# EAGLE design PowerRelayBoard (EAGLE 5.11)
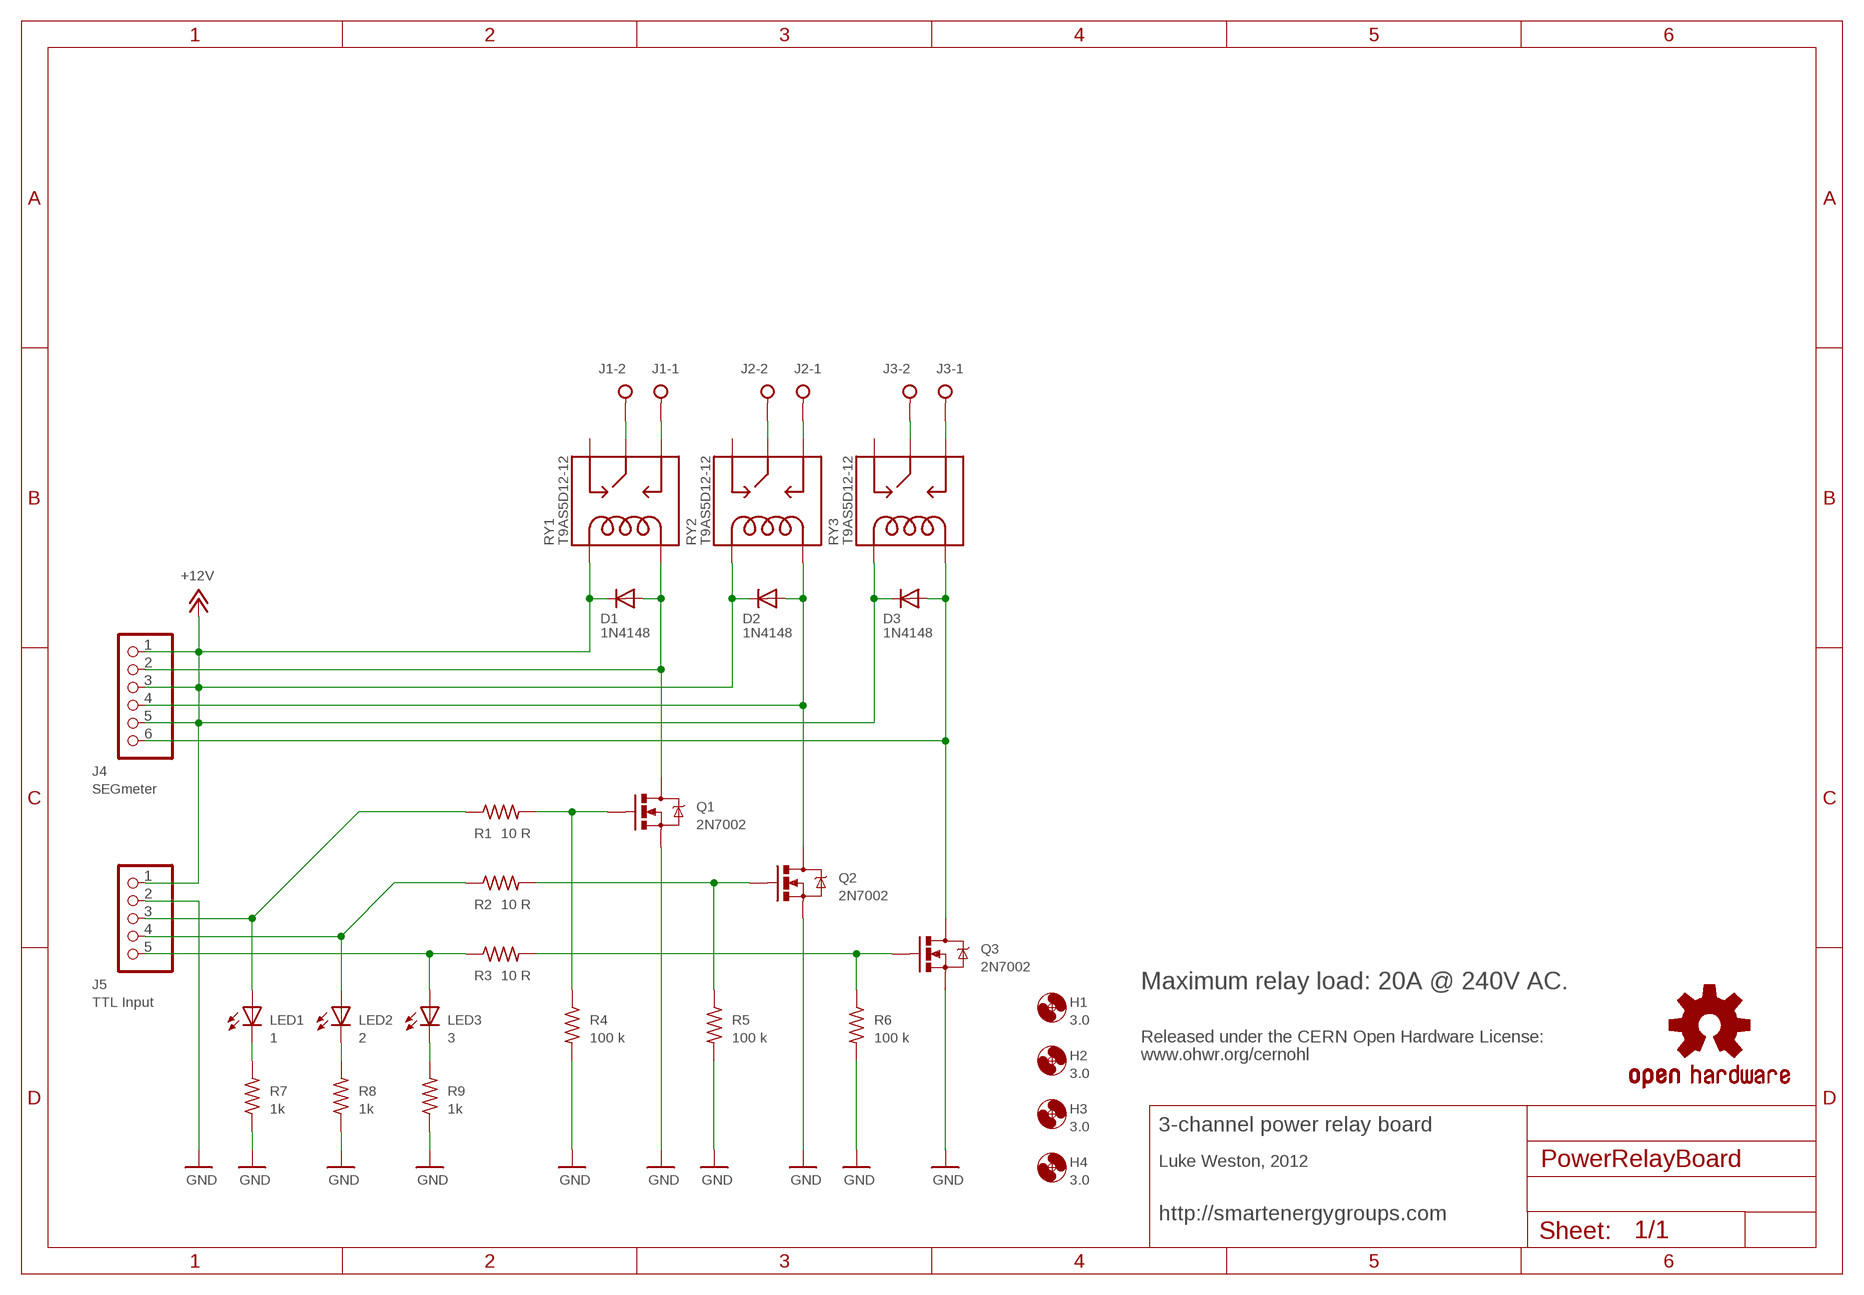
[diagram p0: schematic, sheet 1]

## Parts
D1  1N4148  DIODESOD  [SOD-323]
D2  1N4148  DIODESOD  [SOD-323]
D3  1N4148  DIODESOD  [SOD-323]
H1  3.0  MOUNT-HOLE3.0  [3,0]
H2  3.0  MOUNT-HOLE3.0  [3,0]
H3  3.0  MOUNT-HOLE3.0  [3,0]
H4  3.0  MOUNT-HOLE3.0  [3,0]
J1  1  W237-02P  [W237-132]
J2  2  W237-02P  [W237-132]
J3  3  W237-02P  [W237-132]
J4  SEGmeter  PINHD-1X6  [1X06]
J5  TTL Input  PINHD-1X5  [1X05]
LED1  1  LEDCHIPLED_0805  [CHIPLED_0805]
LED2  2  LEDCHIPLED_0805  [CHIPLED_0805]
LED3  3  LEDCHIPLED_0805  [CHIPLED_0805]
Q1  2N7002  MOSFET-NCHANNELSMD  [SOT23-3]
Q2  2N7002  MOSFET-NCHANNELSMD  [SOT23-3]
Q3  2N7002  MOSFET-NCHANNELSMD  [SOT23-3]
R1  10 R  R-US_M0805  [M0805]
R2  10 R  R-US_M0805  [M0805]
R3  10 R  R-US_M0805  [M0805]
R4  100 k  R-US_M0805  [M0805]
R5  100 k  R-US_M0805  [M0805]
R6  100 k  R-US_M0805  [M0805]
R7  1k  R-US_M0805  [M0805]
R8  1k  R-US_M0805  [M0805]
R9  1k  R-US_M0805  [M0805]
RY1  T9AS5D12-12  RELAYPTH3  [RELAY-T9A-2]
RY2  T9AS5D12-12  RELAYPTH3  [RELAY-T9A-2]
RY3  T9AS5D12-12  RELAYPTH3  [RELAY-T9A-2]
U$  OSHW-LOGOS  [OSHW-LOGO-S]

## Nets
+12V: D1.1(C) D2.1(C) D3.1(C) J4.1 J4.3 J4.5 J5.1 RY1.COIL1 RY2.COIL1 RY3.COIL1
GND: J5.2 Q1.2(S) Q2.2(S) Q3.2(S) R4.2 R5.2 R6.2 R7.1 R8.1 R9.1
N$1: LED2.C R8.2
N$2: D1.2(A) J4.2 Q1.3(D) RY1.COIL2
N$3: LED1.C R7.2
N$4: D2.2(A) J4.4 Q2.3(D) RY2.COIL2
N$5: LED3.C R9.2
N$6: D3.2(A) J4.6 Q3.3(D) RY3.COIL2
N$7: J1.2 RY1.MAIN
N$8: J1.1 RY1.NO
N$9: J2.2 RY2.MAIN
N$10: J2.1 RY2.NO
N$11: J3.2 RY3.MAIN
N$12: J3.1 RY3.NO
N$15: Q1.1(G) R1.2 R4.1
N$16: Q2.1(G) R2.2 R5.1
N$19: Q3.1(G) R3.2 R6.1
N$20: J5.3 LED1.A R1.1
N$21: J5.4 LED2.A R2.1
N$22: J5.5 LED3.A R3.1
Unconnected: RY1.NC RY2.NC RY3.NC

## Notes on the sheet
- Maximum relay load: 20A @ 240V AC.
- Released under the CERN Open Hardware License:
- www.ohwr.org/cernohl
- 3-channel power relay board
- Luke Weston, 2012
- http://smartenergygroups.com

## Library data of the parts
D1-D3 = SparkFun:DIODE: Diode These are standard reverse protection diodes and small signal diodes. SMA package can handle up to about 1A. SOD-323 can handle about 200mA. What the SOD-323 package when ordering, there are some mfgs out there that are 5-pin packages.
H1-H4 = holes:MOUNT-HOLE: MOUNTING HOLE with drill center marker
J1-J3 = con-wago-508:W237-02P: WAGO SREW CLAMP; OC_FARNELL: unknown; OC_NEWARK: unknown
J4 = pinhead:PINHD-1X6: PIN HEADER
J5 = pinhead:PINHD-1X5: PIN HEADER
LED1-LED3 = led:LED: LED OSRAM: - CHIPLED LG R971, LG N971, LY N971, LG Q971, LY Q971, LO R971, LY R971 LH N974, LH R974 LS Q976, LO Q976, LY Q976 LO Q996 - Hyper CHIPLED LW Q18S LB Q993, LB Q99A, LB R99A - SideLED LS A670, LO A670, LY A670, LG A670, LP A670 LB A673, LV A673, LT A673, LW A673 LH A674 LY A675 LS A676, LA A676, LO A676, LY A676, LW A676 LS A679, LY A679, LG A679 - Hyper Micro SIDELED® LS Y876, LA Y876, LO Y876, LY Y876 LT Y87S - SmartLED LW L88C, LW L88S LB L89C, LB L89S, LG L890 LS L89K, LO L89K, LY L89K LS L896, LA L896, LO L896, LY L896 - TOPLED LS T670, LO T670, LY T670, LG T670, LP T670 LSG T670, LSP T670, LSY T670, LOP T670, LYG T670 LG T671, LOG T671, LSG T671 LB T673, LV T673, LT T673, LW T673 LH T674 LS T676, LA T676, LO T676, LY T676, LB T676, LH T676, LSB T676, LW T676 LB T67C, LV T67C, LT T67C, LS T67K, LO T67K, LY T67K, LW E67C LS E67B, LA E67B, LO E67B, LY E67B, LB E67C, LV E67C, LT E67C LW T67C LS T679, LY T679, LG T679 LS T770, LO T770, LY T770, LG T770, LP T770 LB T773, LV T773, LT T773, LW T773 LH T774 LS E675, LA E675, LY E675, LS T675 LS T776, LA T776, LO T776, LY T776, LB T776 LHGB T686 LT T68C, LB T68C - Hyper Mini TOPLED® LB M676 - Mini TOPLED Santana® LG M470 LS M47K, LO M47K, LY M47K Source: http://www.osram.convergy.de LUXEON: - LUMILED® LXK2-PW12-R00, LXK2-PW12-S00, LXK2-PW14-U00, LXK2-PW14-V00 LXK2-PM12-R00, LXK2-PM12-S00, LXK2-PM14-U00 LXK2-PE12-Q00, LXK2-PE12-R00, LXK2-PE12-S00, LXK2-PE14-T00, LXK2-PE14-U00 LXK2-PB12-K00, LXK2-PB12-L00, LXK2-PB12-M00, LXK2-PB14-N00, LXK2-PB14-P00, LXK2-PB14-Q00 LXK2-PR12-L00, LXK2-PR12-M00, LXK2-PR14-Q00, LXK2-PR14-R00 LXK2-PD12-Q00, LXK2-PD12-R00, LXK2-PD12-S00 LXK2-PH12-R00, LXK2-PH12-S00 LXK2-PL12-P00, LXK2-PL12-Q00, LXK2-PL12-R00 Source: www.luxeon.com KINGBRIGHT: KA-3528ASYC Source: www.kingbright.com
Q1-Q3 = freetronics-master-v1:MOSFET-NCHANNEL
R1-R9 = resistor:R-US_: RESISTOR, American symbol
RY1-RY3 = SparkFun:RELAY
U$ = SparkFun:OSHW-LOGO: Open Source Hardware Logo This logo indicates the piece of hardware it is found on incorporates a OSHW license and/or adheres to the definition of open source hardware found here: http://freedomdefined.org/OSHW

## Board
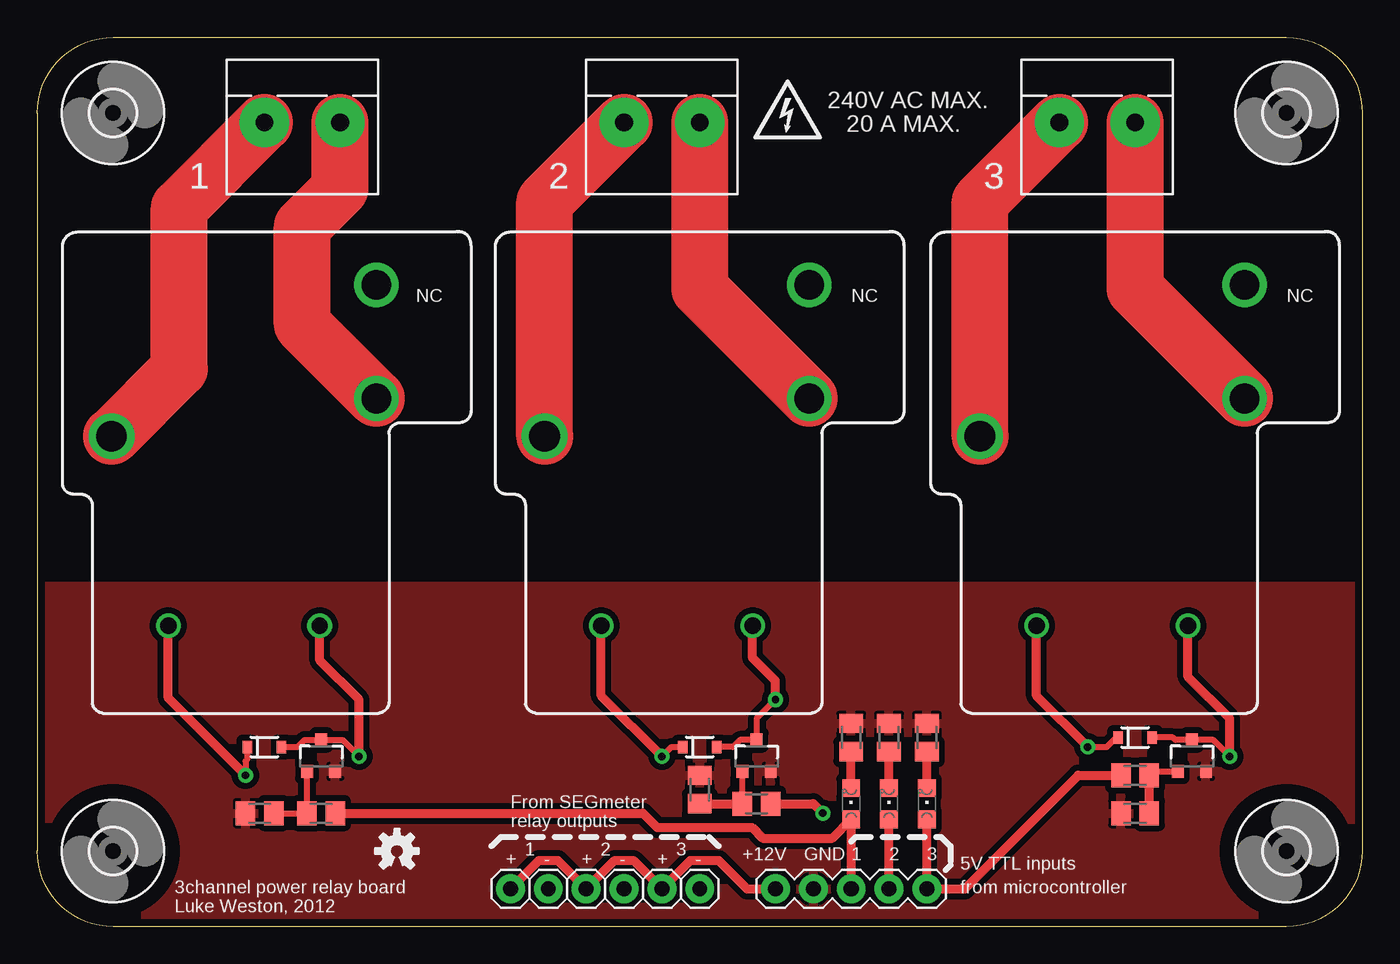
[diagram p1: board, top side]
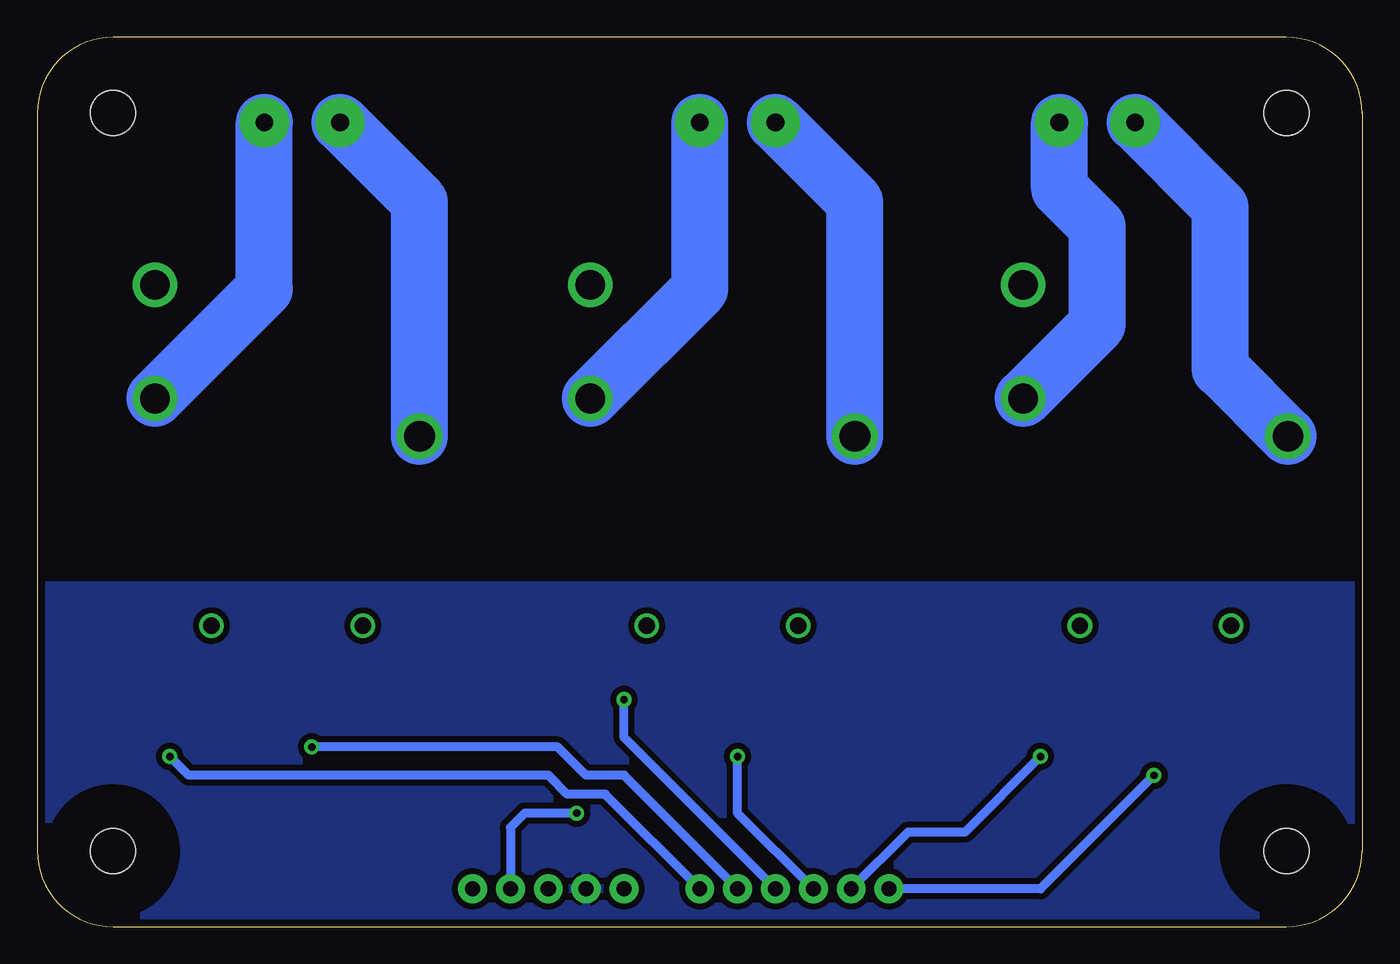
[diagram p2: board, bottom side, seen from below]

Size 88.9 x 59.69 mm. Coordinates in mm from the lower left corner, seen from the top.
Outline: 0,54.61 0,5.08 arc90 5.08,0 83.82,0 arc90 88.9,5.08 88.9,54.61 arc90 83.82,59.69 5.08,59.69 arc90 0,54.61
Copper layers (1*16): Top 0.035mm / dielectric 1.5mm / Bottom 0.035mm
Design rules "PCBCart-Standard": minimum track width 8mil, minimum drill 0.4mm, track to track 8mil, track to pad 8mil, pad to pad 8mil, via to via 8mil, smd to smd 8mil, copper to edge 20mil, drill to drill 8mil, minimum pad ring 8mil, minimum via ring 10mil, stop-mask expansion 3mil, vias tented up to drill 0mil, thermal gap 8mil

### Footprints (pad centres in the part's own frame; a part is rotated, then mirrored left to right if it is on the bottom)
SOD-323 = smd 0.63 x 0.83: 1 -1.15,0; 2 1.15,0
3,0 = hole 3: 0,0
W237-132 = drill 1.194 pad 3.302 round: 1 -2.54,-0.635; 2 2.54,-0.635
1X06 = drill 1 pad 1.93 round: 1 -6.35,0; 2 -3.81,0; 3 -1.27,0; 4 1.27,0; 5 3.81,0; 6 6.35,0
1X05 = drill 1.016 pad 1.93 round: 1 -5.08,0; 2 -2.54,0; 3 0,0; 4 2.54,0; 5 5.08,0
CHIPLED_0805 = smd 1.2 x 1.2: A 0,-1.05; C 0,1.05
SOT23-3 = smd 0.8 x 0.9: 1 -0.95,-1; 2 0.95,-1; 3 0,1.1
M0805 = smd 1.3 x 1.6: 1 -0.95,0; 2 0.95,0
RELAY-T9A-2 = drill 1.1 round: COIL1 -6.61,-10.27; COIL2 3.55,-10.27 | drill 2.057 round: MAIN -10.41,2.43 | drill 2 round: NC 7.35,12.6; NO 7.35,4.97

### Placement (x,y rotation side)
D1  15.24,12.06 0 top
D2  44.45,12.06 0 top
D3  73.66,12.7 0 top
H1  5.08,5.08 0 top
H2  5.08,54.61 0 top
H3  83.82,5.08 0 top
H4  83.82,54.61 0 top
J1  17.78,53.34 180 top
J2  41.91,53.34 180 top
J3  71.12,53.34 180 top
J4  38.1,2.54 0 top
J5  54.61,2.54 0 top
LED1  54.61,8.26 0 top
LED2  57.15,8.26 0 top
LED3  59.69,8.26 0 top
Q1  19.05,11.43 0 top
Q2  48.26,11.43 0 top
Q3  77.47,11.43 0 top
R1  19.05,7.62 180 top
R2  48.26,8.26 180 top
R3  73.66,10.16 0 top
R4  14.92,7.62 180 top
R5  44.45,9.21 90 top
R6  73.66,7.62 180 top
R7  54.61,12.7 270 top
R8  57.15,12.7 270 top
R9  59.69,12.7 270 top
RY1  15.4,30.48 0 top
RY2  44.45,30.48 0 top
RY3  73.66,30.48 0 top
U$  24.13,5.08 0 top

### Tracks (layer width: path | path; a pad name or v marks a point on that pad's centre or on a via)
+12V  (via drill 0.5)
  Top 0.406: v70.48,12.06 71.75,12.06 72.39,12.7 D3.1 | D2.1 42.55,12.06 v41.91,11.43 | D1.1 14.09,11.23 13.97,11.11 v13.97,10.16
  Top 0.61: J4.1 33.66,4.45 34.92,4.45 J4.3 38.73,4.45 40.01,4.45 J4.5 43.81,4.45 45.72,4.45 47.62,2.54 J5.1 | RY3.COIL1 67.05,15.5 v70.48,12.06 | RY1.COIL1 8.79,15.34 v13.97,10.16 | RY2.COIL1 37.84,15.5 v41.91,11.43
  Bottom 0.61: v13.97,10.16 21.59,2.54 J4.1 | v41.91,11.43 41.91,7.62 J4.3 | J4.5 49.53,10.16 52.07,10.16 53.98,12.06 v70.48,12.06
GND
  pour Top (isolate 0.406): -1.27,22.86 90.17,22.86 90.17,-1.27 -1.27,-1.27
  pour Bottom (isolate 0.406): -1.27,22.86 90.17,22.86 90.17,-1.27 -1.27,-1.27
N$1
  Top 0.61: LED2.C R8.2
N$2  (via drill 0.5)
  Top 0.406: v21.59,11.43 20.49,12.53 Q1.3 17.93,12.53 17.46,12.06 D1.2
  Top 0.61: RY1.COIL2 18.95,17.88 21.59,15.24 v21.59,11.43
  Bottom 0.61: J4.2 30.48,6.35 26.67,6.35 v21.59,11.43
N$3
  Top 0.61: LED1.C R7.2
N$4  (via drill 0.5)
  Top 0.406: D2.2 46.67,12.06 47.14,12.53 Q2.3 48.26,13.97 v49.53,15.24
  Top 0.61: RY2.COIL2 48,18.04 49.53,16.51 v49.53,15.24
  Bottom 0.61: v49.53,15.24 49.53,12.7 J4.4
N$5
  Top 0.61: LED3.C R9.2
N$6  (via drill 0.5)
  Top 0.406: D3.2 76.2,12.7 76.37,12.53 Q3.3 78.91,12.53 v80.01,11.43
  Top 0.61: RY3.COIL2 77.21,16.77 80.01,13.97 v80.01,11.43
  Bottom 0.61: J4.6 50.8,8.89 53.34,8.89 54.61,10.16 78.74,10.16 v80.01,11.43
N$7
  Top 3.81: J1.2 9.53,48.26 9.53,37.45 RY1.MAIN
  Bottom 3.81: J1.2 9.53,48.26 9.53,37.45 RY1.MAIN
N$8
  Top 3.81: J1.1 20.32,49.53 17.78,46.99 17.78,40.42 RY1.NO
  Bottom 3.81: J1.1 20.32,49.53 17.78,46.99 17.78,40.42 RY1.NO
N$9
  Top 3.81: J2.2 34.04,48.65 RY2.MAIN
  Bottom 3.81: RY2.MAIN 34.04,48.65 J2.2
N$10
  Top 3.81: RY2.NO 44.45,42.8 J2.1
  Bottom 3.81: J2.1 44.45,42.8 RY2.NO
N$11
  Top 3.81: J3.2 63.25,48.65 RY3.MAIN
  Bottom 3.81: RY3.MAIN 63.25,48.65 J3.2
N$12
  Top 3.81: RY3.NO 73.66,42.8 J3.1
  Bottom 3.81: J3.1 73.66,42.8 RY3.NO
N$15
  Top 0.406: Q1.1 R1.2 R4.1
N$16
  Top 0.406: R2.2 Q2.1
  Top 0.61: R5.1 R2.2
N$19
  Top 0.406: 74.88,10.43 Q3.1
  Top 0.61: 74.88,10.43 R3.2 R6.1
N$20
  Top 0.61: J5.3 LED1.A 53.34,5.93 48.67,5.93 47.94,6.67 41.59,6.67 40.64,7.62 R1.1
N$21  (via drill 0.5)
  Top 0.61: J5.4 LED2.A | R2.1 52.07,8.26 v52.7,7.62
  Bottom 0.61: v52.7,7.62 56.2,7.62 57.15,6.67 J5.4
N$22
  Top 0.61: LED3.A J5.5 62.23,2.54 69.85,10.16 R3.1

### Text on the board
tPlace: 240V AC MAX. | 20 A MAX. | 1 | 2 | 3 | NC | NC | NC | From SEGmeter | relay outputs | 1 | 2 | 3 | + | - | + | - | + | - | +12V | GND | 1 | 2 | 3 | 5V TTL inputs | 3channel power relay board | from microcontroller | Luke Weston, 2012